# Altium schematic sheet 7_Current_Sensing.SchDoc: Current Sensing
size A4; DrawnBy: Sara Vega/ Matheus Frata; Revision: V2.1; SheetNumber: 7; SheetTotal: 7
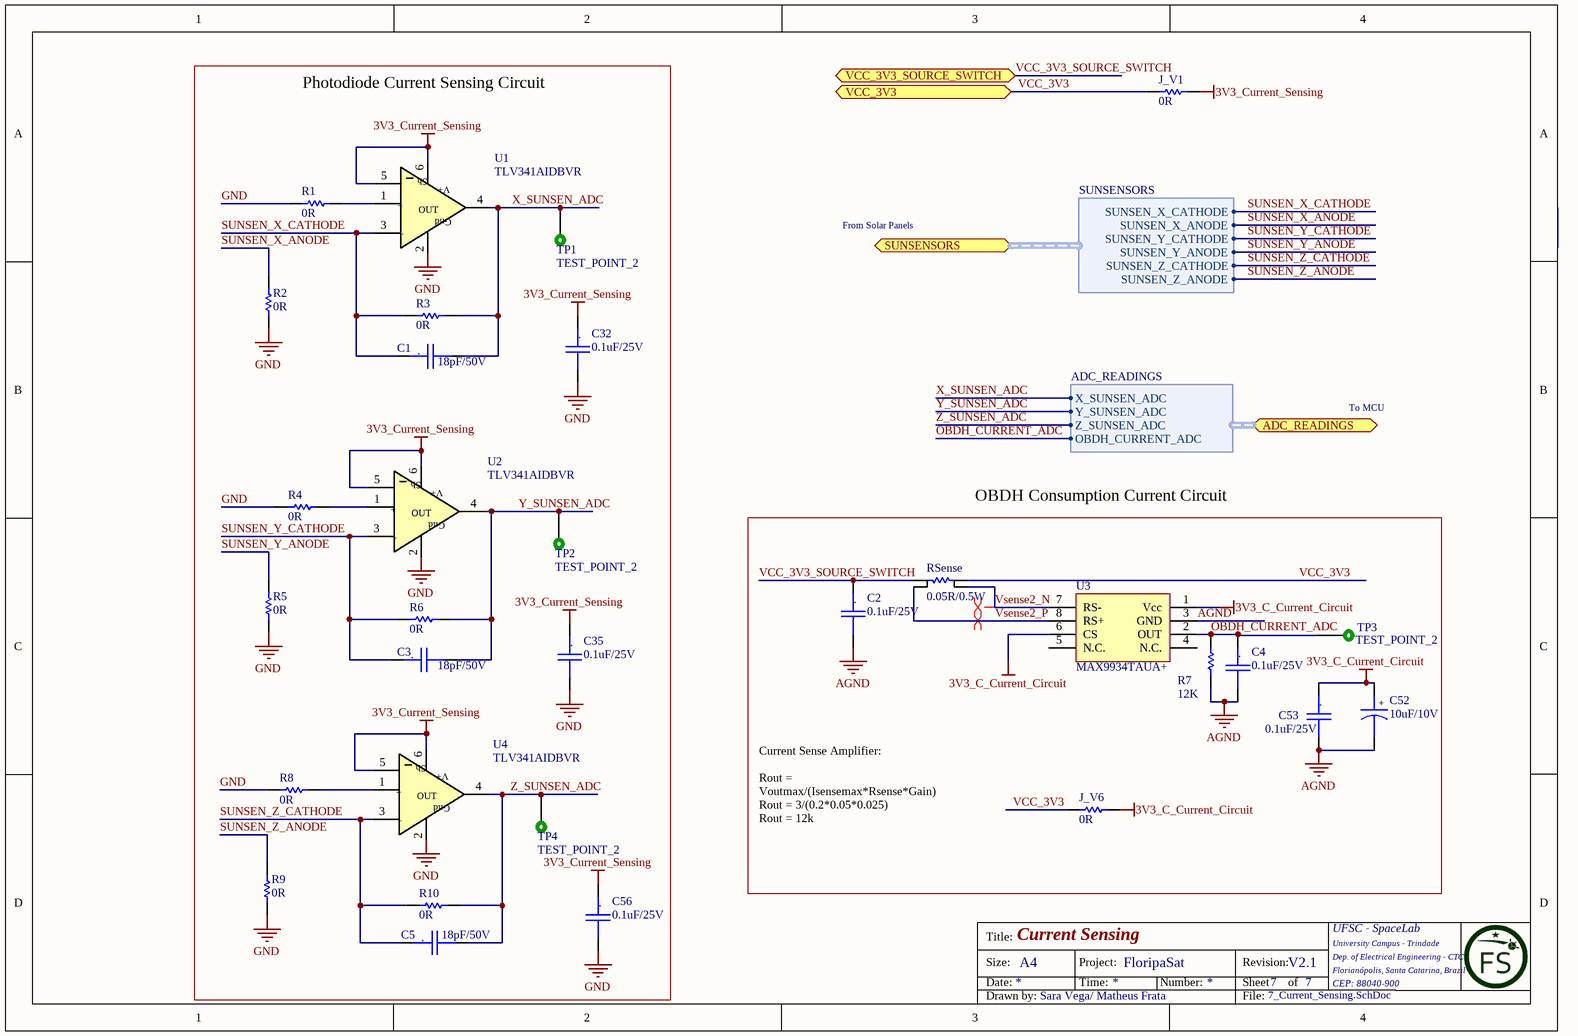
[diagram p0: 7_Current_Sensing.SchDoc]

## Parts
C1  18pF/50V  [CC0805]
C2  0.1uF/25V  [CC0805]
C3  18pF/50V  [CC0805]
C4  0.1uF/25V  [CC0805]
C5  18pF/50V  [CC0805]
C32  0.1uF/25V  [CC0805]
C35  0.1uF/25V  [CC0805]
C52  10uF/10V  [CC0805_Tantalum]
C53  0.1uF/25V  [CC0805]
C56  0.1uF/25V  [CC0805]
J_V1  0R  [0805]
J_V6  0R  [0805]
R1  0R  [0805]
R2  0R  [0805]
R3  0R  [0805]
R4  0R  [0805]
R5  0R  [0805]
R6  0R  [0805]
R7  12K  [0805]
R8  0R  [0805]
R9  0R  [0805]
R10  0R  [0805]
RSense  0.05R/0.5W  [1206 - ohmite]
TP1  TEST_POINT_2  [TEST_POINT_2]  (no BOM)
TP2  TEST_POINT_2  [TEST_POINT_2]  (no BOM)
TP3  TEST_POINT_2  [TEST_POINT_2]  (no BOM)
TP4  TEST_POINT_2  [TEST_POINT_2]  (no BOM)
U1  TLV341AIDBVR  [SOT-23 6L]
U2  TLV341AIDBVR  [SOT-23 6L]
U3  MAX9934TAUA+  [MSOP-8]
U4  TLV341AIDBVR  [SOT-23 6L]

## Blocks framed on the sheet
Photodiode Current Sensing Circuit: C1 C3 C5 C32 C35 C56 R1-R6 R8-R10 TP1 TP2 TP4 U1 U2 U4
OBDH Consumption Current Circuit: C2 C4 C52 C53 J_V6 R7 RSense TP3 U3

## Ports
ADC_READINGS (harness ADC_READINGS), SUNSENSORS (harness SUNSENSORS), VCC_3V3, VCC_3V3_SOURCE_SWITCH

## Harnesses
ADC_READINGS: X_SUNSEN_ADC, Y_SUNSEN_ADC, Z_SUNSEN_ADC, OBDH_CURRENT_ADC
SUNSENSORS: SUNSEN_Z_ANODE, SUNSEN_Z_CATHODE, SUNSEN_Y_ANODE, SUNSEN_Y_CATHODE, SUNSEN_X_ANODE, SUNSEN_X_CATHODE

## Nets
3V3_C_Current_Circuit: C52.1 C53.1 J_V6.1 U3.1(Vcc) U3.6(CS)
3V3_Current_Sensing: C32.1 C35.1 C56.1 J_V1.1 U1.5(EN) U1.6(V+) U2.5(EN) U2.6(V+) U4.5(EN) U4.6(V+)
AGND: C2.2 C4.2 C52.2 C53.2 R7.1 U3.3(GND)
GND: C32.2 C35.2 C56.2 R1.2 R2.1 R4.2 R5.1 R8.2 R9.1 U1.2(Gnd) U2.2(Gnd) U4.2(Gnd)
OBDH_CURRENT_ADC: C4.1 R7.2 TP3.1 U3.2(OUT) ; port ADC_READINGS.OBDH_CURRENT_ADC
SUNSEN_X_ANODE: R2.2 ; port SUNSENSORS.SUNSEN_X_ANODE
SUNSEN_X_CATHODE: C1.1 R3.2 U1.3(-IN) ; port SUNSENSORS.SUNSEN_X_CATHODE
SUNSEN_Y_ANODE: R5.2 ; port SUNSENSORS.SUNSEN_Y_ANODE
SUNSEN_Y_CATHODE: C3.1 R6.2 U2.3(-IN) ; port SUNSENSORS.SUNSEN_Y_CATHODE
SUNSEN_Z_ANODE: R9.2 ; port SUNSENSORS.SUNSEN_Z_ANODE
SUNSEN_Z_CATHODE: C5.1 R10.2 U4.3(-IN) ; port SUNSENSORS.SUNSEN_Z_CATHODE
VCC_3V3: J_V1.2 J_V6.2 RSense.2 ; port VCC_3V3
VCC_3V3_SOURCE_SWITCH: C2.1 RSense.1 ; port VCC_3V3_SOURCE_SWITCH
Vsense2_N: RSense.4 U3.7(RS-)
Vsense2_P: RSense.3 U3.8(RS+)
X_SUNSEN_ADC: C1.2 R3.1 TP1.1 U1.4(OUT) ; port ADC_READINGS.X_SUNSEN_ADC
Y_SUNSEN_ADC: C3.2 R6.1 TP2.1 U2.4(OUT) ; port ADC_READINGS.Y_SUNSEN_ADC
Z_SUNSEN_ADC: C5.2 R10.1 TP4.1 U4.4(OUT) ; port ADC_READINGS.Z_SUNSEN_ADC
NetR1_1: R1.1 U1.1(+IN)
NetR4_1: R4.1 U2.1(+IN)
NetR8_1: R8.1 U4.1(+IN)

Not connected (* = marked no-connect by the designer): U3 4(N.C.) 5(N.C.)

## Layout directives
differential pair: Vsense2_N, Vsense2_P

## Notes on the sheet
- From Solar Panels
- To MCU
- Current Sense Amplifier:
  Rout = Voutmax/(Isensemax*Rsense*Gain)
  Rout = 3/(0.2*0.05*0.025)
  Rout = 12k
- Title:
- Size:
- Date:
- A4
- Project:
- Time:
- FloripaSat
- Number:
- Revision:
- Sheet
- of
- UFSC - SpaceLab
- University Campus - Trindade
- Dep. of Electrical Engineering - CTC
- Florianópolis, Santa Catarina, Brazil
- CEP: 88040-900
- Drawn by:
- File:
- (in symbol Cap_Cer_X7R_0.1uF_25V_0805) .
- (in symbol Cap_Cer_X7R_18pF_50V_0805) .
- (in symbol Cap_Tant_SMD_10uF_10V_0805) +
- (in symbol TLV341AIDBVR) Sh; +; -

## Library data of the parts
C1 C3 C5 = Cap_Cer_X7R_18pF_50V_0805: CAP CER 18pF 50V 5% X7R 0805; Partnumber: CC0805JRNPO9BN180; NCM: 8532.24.10
C2 C4 C32 C35 C53 C56 = Cap_Cer_X7R_0.1uF_25V_0805: CAP CER 0.1UF 25V 10% X7R 0805; Partnumber: CC0805KRX7R8BB104; NCM: 8532.24.10
C52 = Cap_Tant_SMD_10uF_10V_0805: CAP Tantalum 10uF 10V 20% 0805; Partnumber: TPSP106M010R2000; NCM: 8532.21.11
J_V1 J_V6 R1-R6 R8-R10 = R0R_JUMPER_1/16W_0805: RES 0R OHM 1/16W JUMPER 0805; Partnumber: CRCW08050000Z0EA; NCM: 8533.21.20
R7 = R1.65K_1%_1/10W_0805: RES 1.65K OHM 1/10W 0.1% 0805; Partnumber: PCF0805R-1K65BT1; NCM: 8533.21.20
RSense = R0.05R_0.5%_0.5W_1206: Current Sense Resistors - SMD 0.05ohm .5% 4 Terminal; Partnumber: LVK12R050DER; NCM: 8533.21.20
TP1-TP4 = TEST_POINT_2: Test point
U1 U2 U4 = TLV341AIDBVR: Partnumber: TLV341AIDBVR
U3 = MAX9934TAUA+: Partnumber: MAX9934TAUA+